# Altium schematic sheet LINK__PAGE.SchDoc
size A3; SheetNumber: 1; SheetTotal: 12
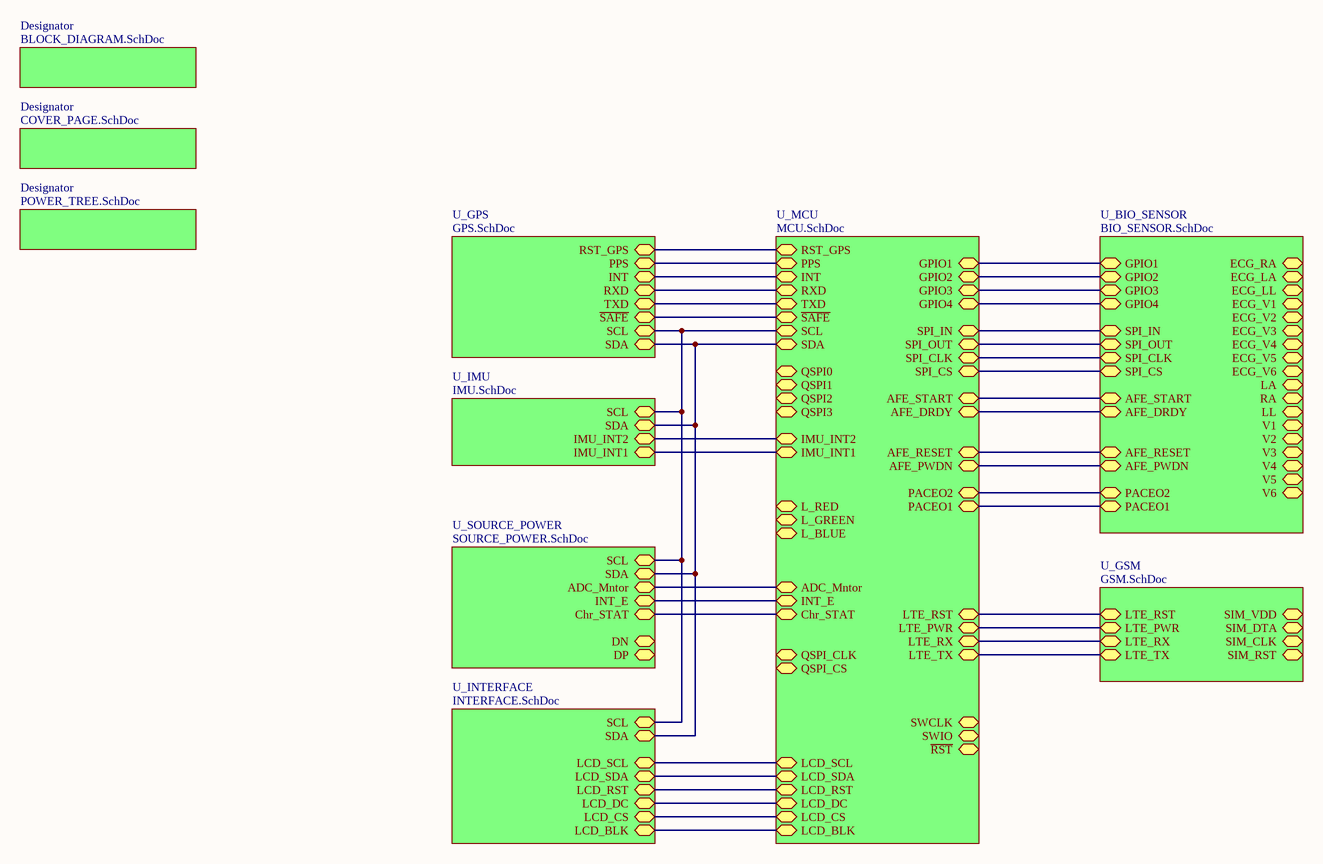
[diagram p0: LINK__PAGE.SchDoc]

## Sub-sheets
Designator = COVER_PAGE.SchDoc: no entries
Designator = BLOCK_DIAGRAM.SchDoc: no entries
Designator = POWER_TREE.SchDoc: no entries
U_BIO_SENSOR = BIO_SENSOR.SchDoc: GPIO1 (bidir), GPIO2 (bidir), GPIO3 (bidir), GPIO4 (bidir), AFE_DRDY (bidir), SPI_IN (bidir), SPI_OUT (bidir), SPI_CLK (bidir), SPI_CS (bidir), AFE_START (bidir), AFE_RESET (bidir), AFE_PWDN (bidir), ECG_RA (bidir), ECG_LA (bidir), ECG_LL (bidir), ECG_V1 (bidir), ECG_V2 (bidir), ECG_V3 (bidir), ECG_V4 (bidir), ECG_V5 (bidir), ECG_V6 (bidir), V6 (bidir), LA (bidir), LL (bidir), RA (bidir), V1 (bidir), V5 (bidir), V4 (bidir), V2 (bidir), V3 (bidir), PACEO2 (bidir), PACEO1 (bidir)
U_GPS = GPS.SchDoc: SDA (bidir), SCL (bidir), ~{SAFE} (bidir), TXD (bidir), RXD (bidir), INT (bidir), PPS (bidir), RST_GPS (bidir)
U_GSM = GSM.SchDoc: LTE_RST (bidir), LTE_PWR (bidir), LTE_RX (bidir), LTE_TX (bidir), SIM_DTA (bidir), SIM_VDD (bidir), SIM_CLK (bidir), SIM_RST (bidir)
U_IMU = IMU.SchDoc: IMU_INT1 (bidir), IMU_INT2 (bidir), SDA (bidir), SCL (bidir)
U_INTERFACE = INTERFACE.SchDoc: LCD_BLK (bidir), LCD_CS (bidir), LCD_DC (bidir), LCD_RST (bidir), LCD_SDA (bidir), LCD_SCL (bidir), SDA (bidir), SCL (bidir)
U_MCU = MCU.SchDoc: QSPI1 (bidir), QSPI_CLK (bidir), QSPI0 (bidir), QSPI_CS (bidir), QSPI2 (bidir), QSPI3 (bidir), L_BLUE (bidir), L_RED (bidir), SPI_IN (bidir), SPI_OUT (bidir), SPI_CLK (bidir), AFE_START (bidir), SPI_CS (bidir), GPIO1 (bidir), GPIO2 (bidir), GPIO3 (bidir), GPIO4 (bidir), PACEO2 (bidir), PACEO1 (bidir), AFE_DRDY (bidir), Chr_STAT (bidir), SCL (bidir), SDA (bidir), INT_E (bidir), ADC_Mntor (bidir), L_GREEN (bidir), ~{SAFE} (bidir), TXD (bidir), RXD (bidir), INT (bidir), PPS (bidir), IMU_INT1 (bidir), IMU_INT2 (bidir), SWCLK (bidir), SWIO (bidir), ~{RST} (bidir), LCD_BLK (bidir), LCD_CS (bidir), LCD_DC (bidir), LCD_RST (bidir), LCD_SDA (bidir), LCD_SCL (bidir), RST_GPS (bidir), AFE_RESET (bidir), AFE_PWDN (bidir), LTE_RST (bidir), LTE_PWR (bidir), LTE_RX (bidir), LTE_TX (bidir)
U_SOURCE_POWER = SOURCE_POWER.SchDoc: DP (bidir), DN (bidir), Chr_STAT (bidir), SCL (bidir), SDA (bidir), INT_E (bidir), ADC_Mntor (bidir)

## Nets
(unnamed): sheet U_IMU/IMU_INT1, sheet U_MCU/IMU_INT1
(unnamed): sheet U_IMU/IMU_INT2, sheet U_MCU/IMU_INT2
(unnamed): sheet U_IMU/SDA, sheet U_SOURCE_POWER/SDA, sheet U_GPS/SDA, sheet U_INTERFACE/SDA, sheet U_MCU/SDA
(unnamed): sheet U_IMU/SCL, sheet U_SOURCE_POWER/SCL, sheet U_GPS/SCL, sheet U_INTERFACE/SCL, sheet U_MCU/SCL
(unnamed): sheet U_SOURCE_POWER/Chr_STAT, sheet U_MCU/Chr_STAT
(unnamed): sheet U_SOURCE_POWER/INT_E, sheet U_MCU/INT_E
(unnamed): sheet U_SOURCE_POWER/ADC_Mntor, sheet U_MCU/ADC_Mntor
(unnamed): sheet U_GPS/~{SAFE}, sheet U_MCU/~{SAFE}
(unnamed): sheet U_GPS/TXD, sheet U_MCU/TXD
(unnamed): sheet U_GPS/RXD, sheet U_MCU/RXD
(unnamed): sheet U_GPS/INT, sheet U_MCU/INT
(unnamed): sheet U_GPS/PPS, sheet U_MCU/PPS
(unnamed): sheet U_GPS/RST_GPS, sheet U_MCU/RST_GPS
(unnamed): sheet U_BIO_SENSOR/GPIO1, sheet U_MCU/GPIO1
(unnamed): sheet U_BIO_SENSOR/GPIO2, sheet U_MCU/GPIO2
(unnamed): sheet U_BIO_SENSOR/GPIO3, sheet U_MCU/GPIO3
(unnamed): sheet U_BIO_SENSOR/GPIO4, sheet U_MCU/GPIO4
(unnamed): sheet U_BIO_SENSOR/AFE_DRDY, sheet U_MCU/AFE_DRDY
(unnamed): sheet U_BIO_SENSOR/SPI_IN, sheet U_MCU/SPI_IN
(unnamed): sheet U_BIO_SENSOR/SPI_OUT, sheet U_MCU/SPI_OUT
(unnamed): sheet U_BIO_SENSOR/SPI_CLK, sheet U_MCU/SPI_CLK
(unnamed): sheet U_BIO_SENSOR/SPI_CS, sheet U_MCU/SPI_CS
(unnamed): sheet U_BIO_SENSOR/AFE_START, sheet U_MCU/AFE_START
(unnamed): sheet U_BIO_SENSOR/AFE_RESET, sheet U_MCU/AFE_RESET
(unnamed): sheet U_BIO_SENSOR/AFE_PWDN, sheet U_MCU/AFE_PWDN
(unnamed): sheet U_BIO_SENSOR/PACEO2, sheet U_MCU/PACEO2
(unnamed): sheet U_BIO_SENSOR/PACEO1, sheet U_MCU/PACEO1
(unnamed): sheet U_INTERFACE/LCD_BLK, sheet U_MCU/LCD_BLK
(unnamed): sheet U_INTERFACE/LCD_CS, sheet U_MCU/LCD_CS
(unnamed): sheet U_INTERFACE/LCD_DC, sheet U_MCU/LCD_DC
(unnamed): sheet U_INTERFACE/LCD_RST, sheet U_MCU/LCD_RST
(unnamed): sheet U_INTERFACE/LCD_SDA, sheet U_MCU/LCD_SDA
(unnamed): sheet U_INTERFACE/LCD_SCL, sheet U_MCU/LCD_SCL
(unnamed): sheet U_MCU/LTE_RST, sheet U_GSM/LTE_RST
(unnamed): sheet U_MCU/LTE_PWR, sheet U_GSM/LTE_PWR
(unnamed): sheet U_MCU/LTE_RX, sheet U_GSM/LTE_RX
(unnamed): sheet U_MCU/LTE_TX, sheet U_GSM/LTE_TX